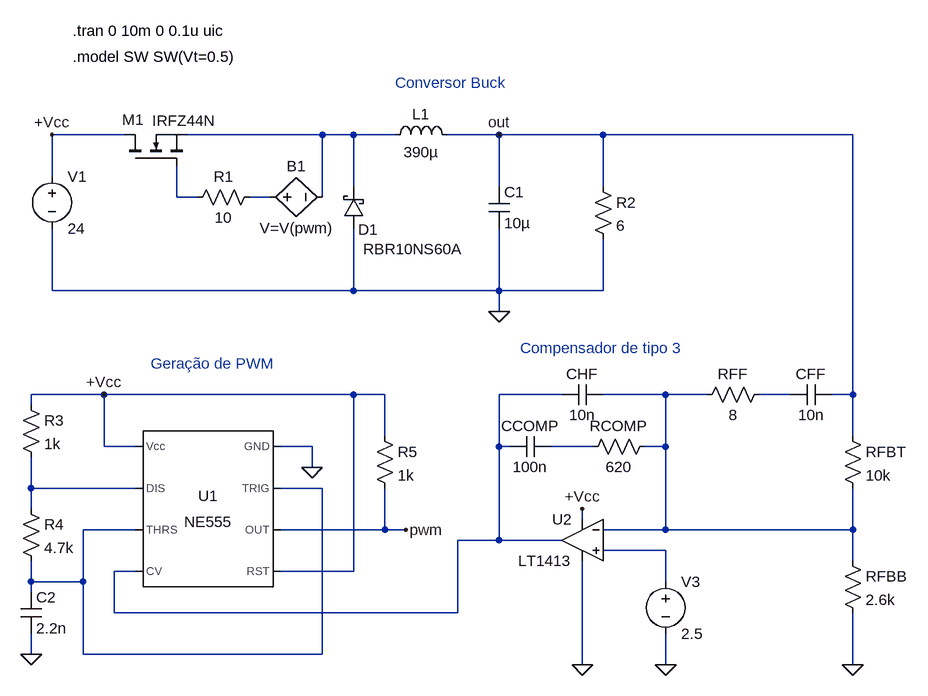
[diagram p0: schematic Buck_Com_555_MG.asc]
Buck_Com_555_MG.asc, the LTspice schematic file:
Version 4.1
SHEET 1 2036 996
WIRE -240 96 -352 96
WIRE 64 96 -144 96
WIRE 112 96 64 96
WIRE 176 96 112 96
WIRE 336 96 256 96
WIRE 496 96 336 96
WIRE 880 96 496 96
WIRE -352 160 -352 96
WIRE 112 176 112 96
WIRE 336 176 336 96
WIRE 496 176 496 96
WIRE -160 192 -160 144
WIRE -128 192 -160 192
WIRE -16 192 -48 192
WIRE 64 192 64 96
WIRE -352 336 -352 240
WIRE 112 336 112 240
WIRE 112 336 -352 336
WIRE 336 336 336 240
WIRE 336 336 112 336
WIRE 496 336 496 256
WIRE 496 336 336 336
WIRE 336 368 336 336
WIRE -272 496 -384 496
WIRE 112 496 -272 496
WIRE 160 496 112 496
WIRE 432 496 336 496
WIRE 592 496 496 496
WIRE 656 496 592 496
WIRE 784 496 736 496
WIRE 880 496 880 96
WIRE 880 496 848 496
WIRE -384 512 -384 496
WIRE 160 560 160 496
WIRE 880 560 880 496
WIRE -272 576 -272 496
WIRE -224 576 -272 576
WIRE 48 576 0 576
WIRE 336 576 336 496
WIRE 352 576 336 576
WIRE 480 576 416 576
WIRE 592 576 592 496
WIRE 592 576 560 576
WIRE 48 608 48 576
WIRE -384 640 -384 592
WIRE -224 640 -384 640
WIRE 64 640 0 640
WIRE -384 672 -384 640
WIRE 464 688 464 672
WIRE -224 704 -304 704
WIRE 160 704 160 640
WIRE 160 704 0 704
WIRE 192 704 160 704
WIRE 592 704 592 576
WIRE 592 704 496 704
WIRE 880 704 880 640
WIRE 880 704 592 704
WIRE 336 720 336 576
WIRE 336 720 272 720
WIRE 432 720 336 720
WIRE 592 736 496 736
WIRE 880 752 880 704
WIRE -224 768 -256 768
WIRE 112 768 112 496
WIRE 112 768 0 768
WIRE -384 784 -384 752
WIRE -304 784 -304 704
WIRE -304 784 -384 784
WIRE 592 784 592 736
WIRE -384 800 -384 784
WIRE -256 832 -256 768
WIRE 272 832 272 720
WIRE 272 832 -256 832
WIRE -384 896 -384 864
WIRE -304 896 -304 784
WIRE 64 896 64 640
WIRE 64 896 -304 896
WIRE 464 912 464 752
WIRE 592 912 592 864
WIRE 880 912 880 832
FLAG -384 896 0
FLAG 48 608 0
FLAG 192 704 pwm
FLAG 880 912 0
FLAG 336 368 0
FLAG -272 496 +Vcc
FLAG 592 912 0
FLAG 464 912 0
FLAG 464 672 +Vcc
FLAG 336 96 out
FLAG -352 96 +Vcc
SYMBOL Misc\\NE555 -112 672 M0
SYMATTR InstName U1
SYMBOL res -400 496 R0
SYMATTR InstName R3
SYMATTR Value 1k
SYMBOL cap -400 800 R0
SYMATTR InstName C2
SYMATTR Value 2.2n
SYMBOL res -400 656 R0
SYMATTR InstName R4
SYMATTR Value 4.7k
SYMBOL res 144 544 R0
SYMATTR InstName R5
SYMATTR Value 1k
SYMBOL res 864 544 R0
SYMATTR InstName RFBT
SYMATTR Value 10k
SYMBOL res 864 736 R0
SYMATTR InstName RFBB
SYMATTR Value 2.6k
SYMBOL ind 160 112 R270
WINDOW 0 32 56 VTop 2
WINDOW 3 5 56 VBottom 2
SYMATTR InstName L1
SYMATTR Value 390µ
SYMBOL cap 320 176 R0
SYMATTR InstName C1
SYMATTR Value 10µ
SYMBOL res 480 160 R0
SYMATTR InstName R2
SYMATTR Value 6
SYMBOL voltage -352 144 R0
WINDOW 123 0 0 Left 0
WINDOW 39 0 0 Left 0
SYMATTR InstName V1
SYMATTR Value 24
SYMBOL schottky 128 240 R180
WINDOW 0 -22 -2 Left 2
WINDOW 3 -152 -32 Left 2
SYMATTR InstName D1
SYMATTR Value RBR10NS60A
SYMATTR Description Diode
SYMATTR Type diode
SYMBOL bv -32 192 R270
WINDOW 0 32 56 VTop 2
WINDOW 3 -32 56 VBottom 2
SYMATTR InstName B1
SYMATTR Value V=V(pwm)
SYMBOL res -32 176 R90
WINDOW 0 0 56 VBottom 2
WINDOW 3 32 56 VTop 2
SYMATTR InstName R1
SYMATTR Value 10
SYMBOL nmos -240 144 R270
WINDOW 0 71 -4 VRight 2
WINDOW 3 70 42 VRight 2
SYMATTR InstName M1
SYMATTR Value IRFZ44N
SYMBOL voltage 592 768 R0
WINDOW 123 0 0 Left 0
WINDOW 39 0 0 Left 0
SYMATTR InstName V3
SYMATTR Value 2.5
SYMBOL res 576 560 R90
WINDOW 0 0 56 VBottom 2
WINDOW 3 32 56 VTop 2
SYMATTR InstName RCOMP
SYMATTR Value 620
SYMBOL cap 416 560 R90
WINDOW 0 0 32 VBottom 2
WINDOW 3 32 32 VTop 2
SYMATTR InstName CCOMP
SYMATTR Value 100n
SYMBOL cap 496 480 R90
WINDOW 0 0 32 VBottom 2
WINDOW 3 32 32 VTop 2
SYMATTR InstName CHF
SYMATTR Value 10n
SYMBOL OpAmps\\LT1413 464 656 M0
SYMATTR InstName U2
SYMBOL res 752 480 R90
WINDOW 0 0 56 VBottom 2
WINDOW 3 32 56 VTop 2
SYMATTR InstName RFF
SYMATTR Value 8
SYMBOL cap 848 480 R90
WINDOW 0 0 32 VBottom 2
WINDOW 3 32 32 VTop 2
SYMATTR InstName CFF
SYMATTR Value 10n
TEXT -320 -64 Left 2 !.tran 0 10m 0 0.1u uic
TEXT -320 -24 Left 2 !.model SW SW(Vt=0.5)
TEXT 176 16 Left 2 ;Conversor Buck
TEXT -200 448 Left 2 ;Geração de PWM
TEXT 368 424 Left 2 ;Compensador de tipo 3

The netlist it stands for:
* Buck_Com_555_MG.asc
X§U1 0 N009 pwm +Vcc N004 N009 N008 +Vcc NE555  ; pins GND TRIG OUT RST CV THRS DIS Vcc
R3 +Vcc N008 1k
C2 N009 0 2.2n
R4 N008 N009 4.7k
R5 +Vcc pwm 1k
RFBT out N005 10k
RFBB N005 0 2.6k
L1 N001 out 390µ
C1 out 0 10µ
R2 out 0 6
V1 +Vcc 0 24
D1 0 N001 RBR10NS60A
B1 N003 N001 V=V(pwm)
R1 N003 N002 10
M1 +Vcc N002 N001 N001 IRFZ44N
V3 N010 0 2.5
RCOMP N005 N007 620
CCOMP N007 N004 100n
CHF N005 N004 10n
X§U2 N010 N005 +Vcc 0 N004 LT1413  ; pins In+ In- V+ V- OUT
RFF N006 N005 8
CFF out N006 10n
.model D D
.lib standard.dio
.model NMOS NMOS
.model PMOS PMOS
.lib standard.mos
.tran 0 10m 0 0.1u uic
.model SW SW(Vt=0.5)
* Conversor Buck
* Geração de PWM
* Compensador de tipo 3
.lib NE555.sub
.lib LTC.lib
.backanno
.end